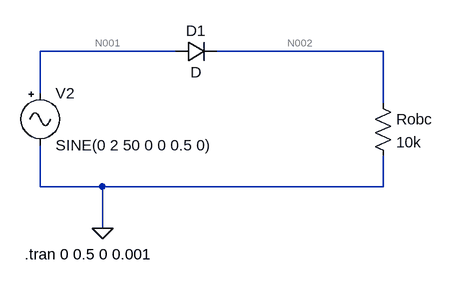
[diagram p0: schematic schemat.asc]
schemat.asc, the LTspice schematic file:
Version 4
SHEET 1 880 680
WIRE 64 -16 -144 -16
WIRE 384 -16 128 -16
WIRE -144 48 -144 -16
WIRE 384 64 384 -16
WIRE -144 192 -144 128
WIRE -48 192 -144 192
WIRE 384 192 384 144
WIRE 384 192 -48 192
WIRE -48 256 -48 192
FLAG -48 256 0
SYMBOL Misc\\signal -144 32 R0
WINDOW 123 0 0 Left 0
WINDOW 39 0 0 Left 0
SYMATTR InstName V2
SYMATTR Value SINE(0 2 50 0 0 0.5 0)
SYMBOL res 368 48 R0
SYMATTR InstName Robc
SYMATTR Value 10k
SYMBOL diode 64 0 R270
WINDOW 0 32 32 VTop 2
WINDOW 3 0 32 VBottom 2
SYMATTR InstName D1
TEXT -168 296 Left 2 !.tran 0 0.5 0 0.001

The netlist it stands for:
* schemat.asc
V2 N001 0 SINE(0 2 50 0 0 0.5 0)
Robc N002 0 10k
D1 N001 N002 D
.model D D
.lib standard.dio
.tran 0 0.5 0 0.001
.backanno
.end

* Results of the author's LTspice run, read from the files saved beside the schematic
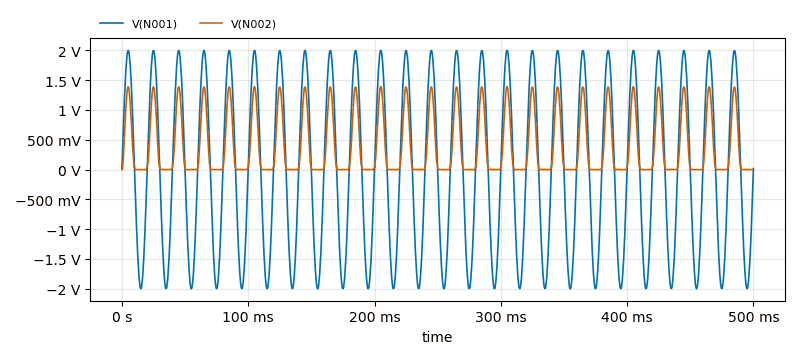
[diagram p1: Transient Analysis of schemat.asc, plotted from the saved traces]
* Transient Analysis, 1 run:
*   V(N001): min -2 V, max 2 V, average 2.235 µV, rms 1.418 V, last 17.45 mV
*   V(N002): min 0 V, max 1.391 V, average 377.7 mV, rms 632.5 mV, last 0 V